# EAGLE schematic Clock_generator (EAGLE 9.6.2)
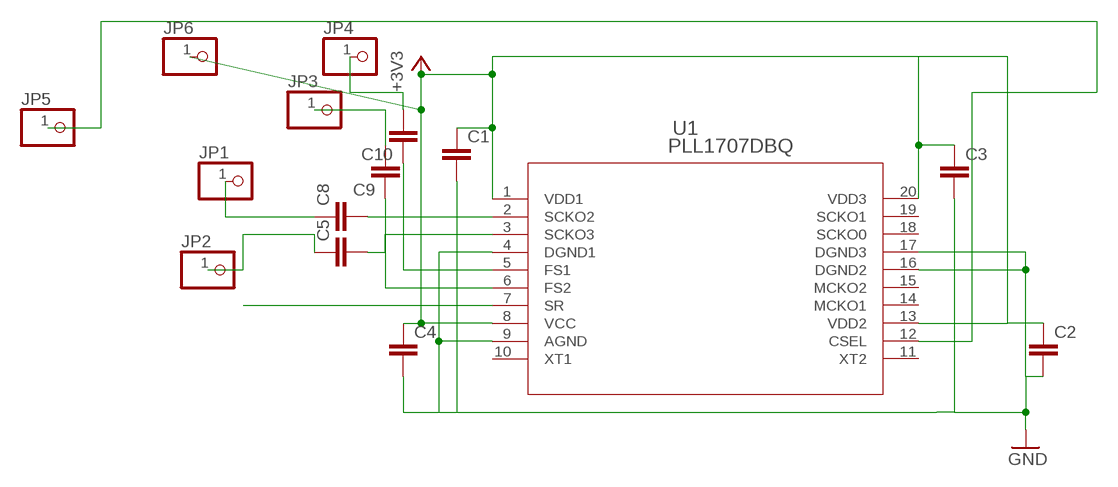
[diagram p0: schematic, sheet 1]

## Parts
C1  C-EUC0805K  [C0805K]
C2  C-EUC0805K  [C0805K]
C3  C-EUC0805K  [C0805K]
C4  C-EUC0805K  [C0805K]
C5  C-EUC0805K  [C0805K]
C8  C-EUC0805K  [C0805K]
C9  C-EUC0805K  [C0805K]
C10  C-EUC0805K  [C0805K]
JP1  PINHD-1X1  [1X01]
JP2  PINHD-1X1  [1X01]
JP3  PINHD-1X1  [1X01]
JP4  PINHD-1X1  [1X01]
JP5  PINHD-1X1  [1X01]
JP6  PINHD-1X1  [1X01]
U1  PLL1707DBQ  [DBQ20]

## Nets
+3V3: C1.1 C2.1 C3.1 C4.1 JP6.1 U1.1(VDD1) U1.8(VCC) U1.13(VDD2) U1.20(VDD3)
GND: C1.2 C2.2 C3.2 C4.2 U1.4(DGND1) U1.9(AGND) U1.16(DGND2) U1.17(DGND3)
N$1: C8.2 U1.2(SCKO2)
N$2: C5.2 U1.3(SCKO3)
N$5: C8.1 JP1.1
N$6: C5.1 JP2.1
N$9: C10.1 U1.5(FS1)
N$10: C9.1 U1.6(FS2)
N$11: JP5.1 U1.12(CSEL)
N$12: C9.2 JP3.1
N$13: U1.7(SR)
N$14: C10.2 JP4.1
Unconnected: U1.10(XT1) U1.11(XT2) U1.14(MCKO1) U1.15(MCKO2) U1.18(SCKO0) U1.19(SCKO1)

## Library data of the parts
C1-C5 C8-C10 = rcl:C-EU: CAPACITOR, European symbol; SPICEPREFIX: C
JP1-JP6 = pinhead:PINHD-1X1: PIN HEADER
U1 = PLL1707:PLL1707DBQ; DATASHEET_URL: http://www.ti.com/lit/gpn/PLL1707; DESCRIPTION: 3.3 V Dual PLL Multi-Clock Generator; FAMILY_NAME: AUDIO CLOCKS; GENERIC_PART_NUMBER: PLL1707; INDUSTRY_STD_PKG_TYPE: SSOP/QSOP; MANUFACTURER: Texas Instruments; MANUFACTURER_PART_NUMBER: PLL1707DBQ; PACKAGE_DESIGNATOR: DBQ; PIN_COUNT: 20; VENDOR: Texas Instruments